# EAGLE design M105B (EAGLE 6.6.0)
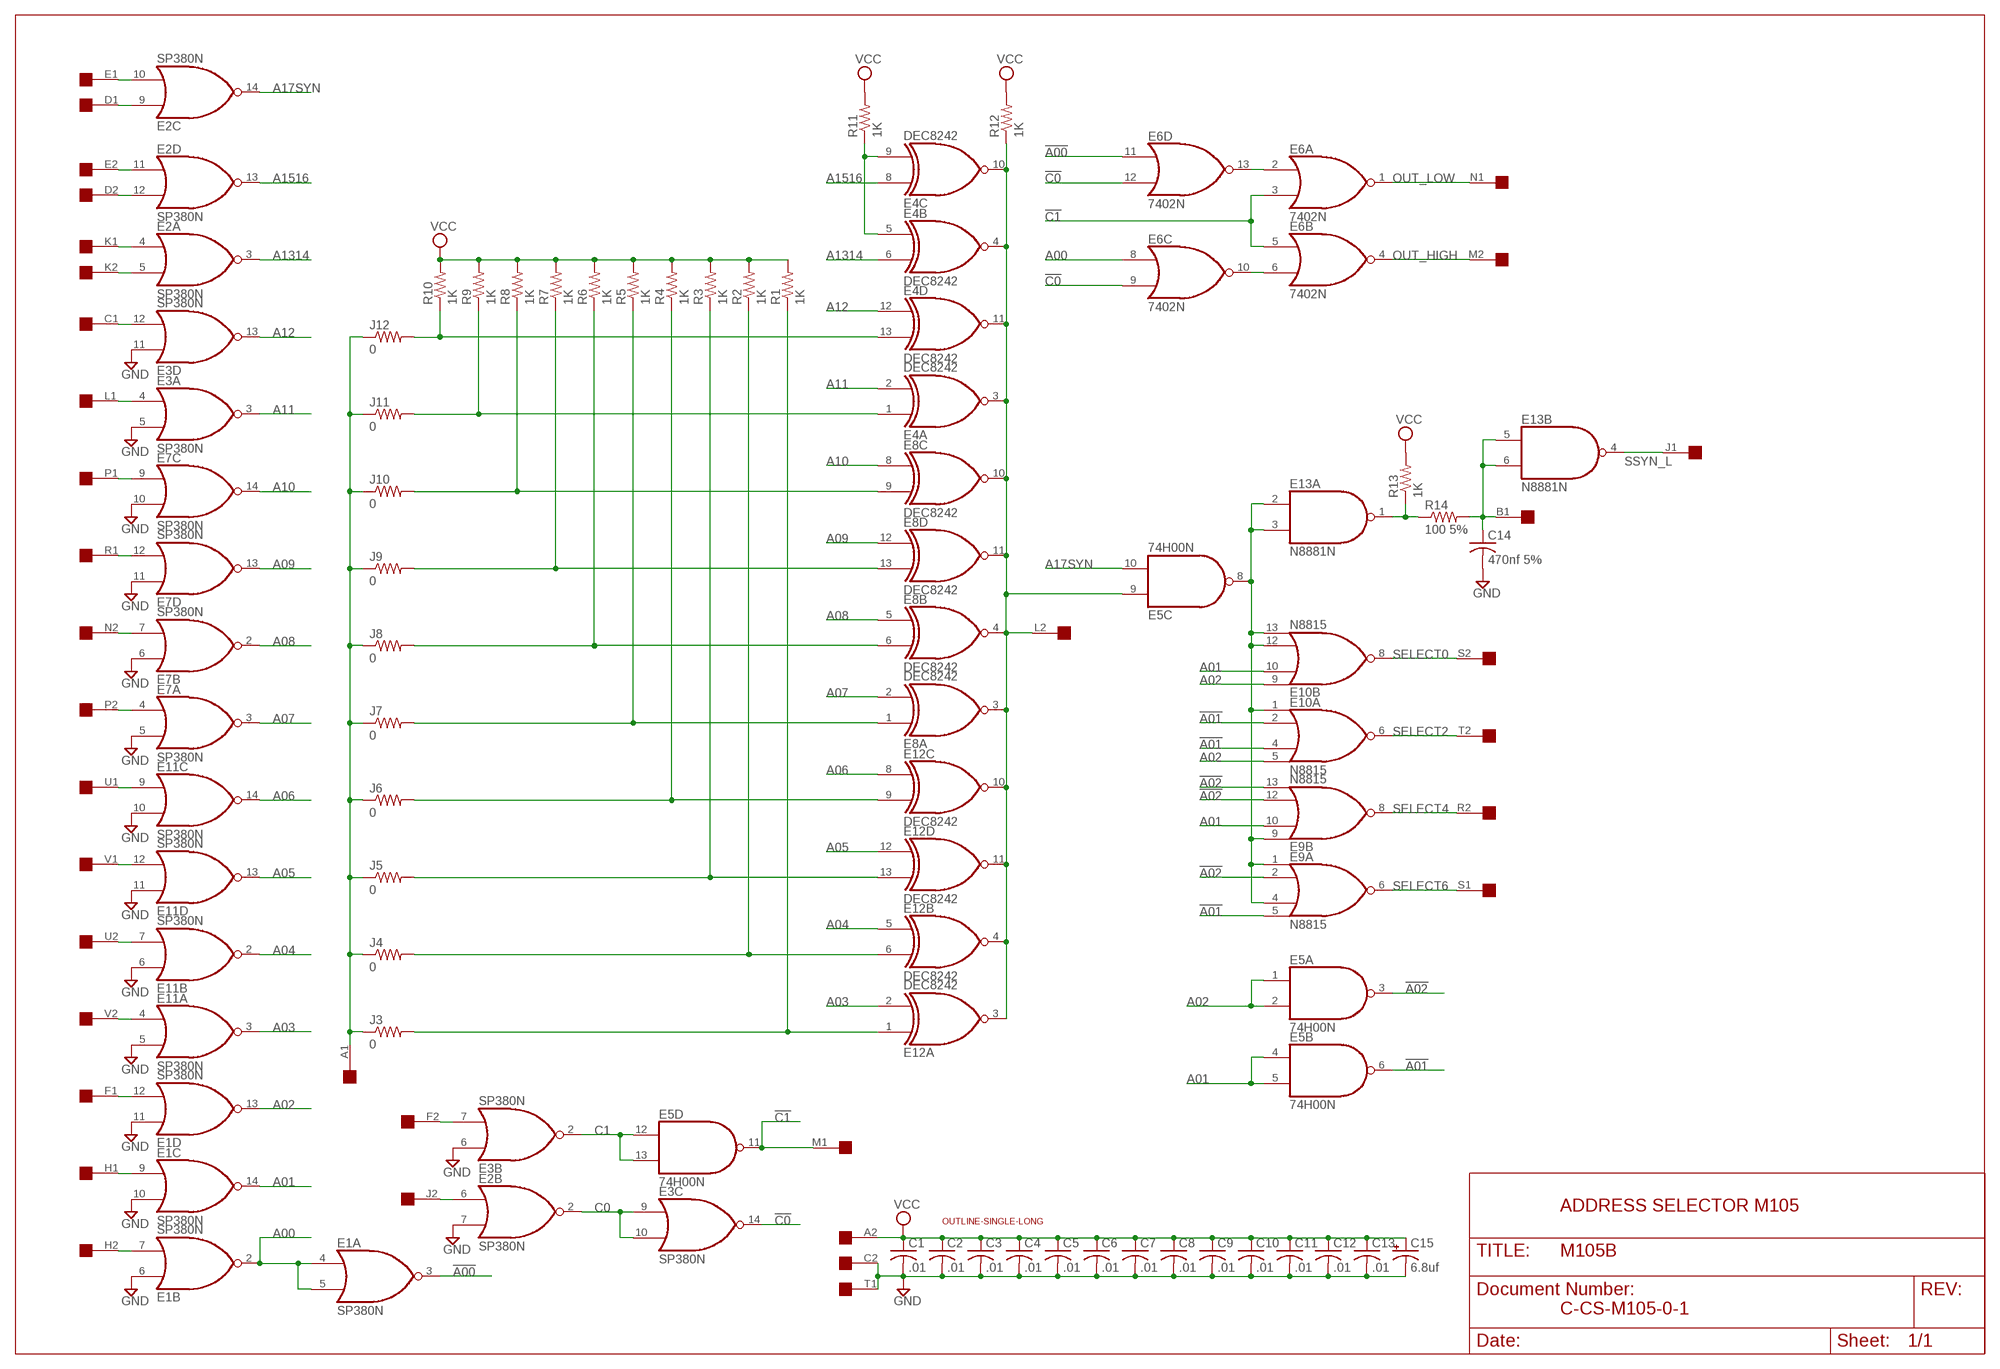
[diagram p0: schematic, sheet 1]

## Parts
C1  .01  C-US050-025X075  [C050-025X075]
C2  .01  C-US050-025X075  [C050-025X075]
C3  .01  C-US050-025X075  [C050-025X075]
C4  .01  C-US050-025X075  [C050-025X075]
C5  .01  C-US050-025X075  [C050-025X075]
C6  .01  C-US050-025X075  [C050-025X075]
C7  .01  C-US050-025X075  [C050-025X075]
C8  .01  C-US050-025X075  [C050-025X075]
C9  .01  C-US050-025X075  [C050-025X075]
C10  .01  C-US050-025X075  [C050-025X075]
C11  .01  C-US050-025X075  [C050-025X075]
C12  .01  C-US050-025X075  [C050-025X075]
C13  .01  C-US050-025X075  [C050-025X075]
C14  470nf 5%  C-US050-025X075  [C050-025X075]
C15  6.8uf  CPOL-USE15-5AXIAL  [E15-5]
E1  SP380N  [DIL14]
E2  SP380N  [DIL14]
E3  SP380N  [DIL14]
E4  DEC8242  74LS266N  [DIL14]
E5  74H00N  74S00N  [DIL14]
E6  7402N  [DIL14]
E7  SP380N  [DIL14]
E8  DEC8242  74LS266N  [DIL14]
E9  N8815  [DIL14]
E10  N8815  [DIL14]
E11  SP380N  [DIL14]
E12  DEC8242  74LS266N  [DIL14]
E13  N8881N  [DIL14]
J3  0  R-US_0207/10  [0207/10]
J4  0  R-US_0207/10  [0207/10]
J5  0  R-US_0207/10  [0207/10]
J6  0  R-US_0207/10  [0207/10]
J7  0  R-US_0207/10  [0207/10]
J8  0  R-US_0207/10  [0207/10]
J9  0  R-US_0207/10  [0207/10]
J10  0  R-US_0207/10  [0207/10]
J11  0  R-US_0207/10  [0207/10]
J12  0  R-US_0207/10  [0207/10]
R1  1K  R-US_0207/10  [0207/10]
R2  1K  R-US_0207/10  [0207/10]
R3  1K  R-US_0207/10  [0207/10]
R4  1K  R-US_0207/10  [0207/10]
R5  1K  R-US_0207/10  [0207/10]
R6  1K  R-US_0207/10  [0207/10]
R7  1K  R-US_0207/10  [0207/10]
R8  1K  R-US_0207/10  [0207/10]
R9  1K  R-US_0207/10  [0207/10]
R10  1K  R-US_0207/10  [0207/10]
R11  1K  R-US_0207/10  [0207/10]
R12  1K  R-US_0207/10  [0207/10]
R13  1K  R-US_0207/10  [0207/10]
R14  100 5%  R-US_0207/10  [0207/10]
U$1  SINGLE  [EDGE-CON2]
U$2  OUTLINE-SINGLE-LONG  [SINGLE-LONG]

## Nets
!A00: E1.3(A:O) E6.11(D:I0)
!A01: E5.6(B:O) E9.5(A:I3) E10.2(A:I1) E10.4(A:I2)
!A02: E5.3(A:O) E9.2(A:I1) E9.12(B:I2) E9.13(B:I3)
!C0: E3.14(C:O) E6.9(C:I1) E6.12(D:I1)
!C1: E5.11(D:O) E6.3(A:I1) E6.5(B:I0) U$1.M1
A00: E1.2(B:O) E1.4(A:I0) E1.5(A:I1) E6.8(C:I0)
A01: E1.14(C:O) E5.4(B:I0) E5.5(B:I1) E9.10(B:I1) E10.10(B:I1)
A02: E1.13(D:O) E5.1(A:I0) E5.2(A:I1) E10.5(A:I3) E10.9(B:I0)
A03: E11.3(A:O) E12.2(A:I1)
A04: E11.2(B:O) E12.5(B:I0)
A05: E11.13(D:O) E12.12(D:I0)
A06: E11.14(C:O) E12.8(C:I0)
A07: E7.3(A:O) E8.2(A:I1)
A08: E7.2(B:O) E8.5(B:I0)
A09: E7.13(D:O) E8.12(D:I0)
A10: E7.14(C:O) E8.8(C:I0)
A11: E3.3(A:O) E4.2(A:I1)
A12: E3.13(D:O) E4.12(D:I0)
A17SYN: E2.14(C:O) E5.10(C:I1)
A1314: E2.3(A:O) E4.6(B:I1)
A1516: E2.13(D:O) E4.8(C:I0)
C0: E2.2(B:O) E3.9(C:I0) E3.10(C:I1)
C1: E3.2(B:O) E5.12(D:I0) E5.13(D:I1)
GND [Supply]: C1.2 C2.2 C3.2 C4.2 C5.2 C6.2 C7.2 C8.2 C9.2 C10.2 C11.2 C12.2 C13.2 C14.2 C15.- E1.6(B:I0) E1.10(C:I1) E1.11(D:I0) E2.7(B:I1) E3.5(A:I1) E3.6(B:I0) E3.11(D:I0) E7.5(A:I1) E7.6(B:I0) E7.10(C:I1) E7.11(D:I0) E11.5(A:I1) E11.6(B:I0) E11.10(C:I1) E11.11(D:I0) U$1.C2 U$1.T1
N$1: E2.10(C:I1) U$1.E1
N$2: E2.9(C:I0) U$1.D1
N$3: E2.11(D:I0) U$1.E2
N$4: E2.12(D:I1) U$1.D2
N$5: E2.4(A:I0) U$1.K1
N$6: E2.5(A:I1) U$1.K2
N$7: E3.12(D:I1) U$1.C1
N$8: E3.4(A:I0) U$1.L1
N$9: E7.9(C:I0) U$1.P1
N$10: E7.7(B:I1) U$1.N2
N$11: E7.12(D:I1) U$1.R1
N$12: E7.4(A:I0) U$1.P2
N$13: E11.9(C:I0) U$1.U1
N$14: E11.12(D:I1) U$1.V1
N$15: E11.7(B:I1) U$1.U2
N$16: E11.4(A:I0) U$1.V2
N$17: E1.12(D:I1) U$1.F1
N$18: E1.7(B:I1) U$1.H2
N$19: E1.9(C:I0) U$1.H1
N$20: J3.1 J4.1 J5.1 J6.1 J7.1 J8.1 J9.1 J10.1 J11.1 J12.1 U$1.A1
N$21: E4.13(D:I1) J12.2 R10.1
N$22: E13.1(A:O) R13.1 R14.1
N$23: E2.6(B:I0) U$1.J2
N$24: E3.7(B:I1) U$1.F2
N$25: E5.8(C:O) E9.1(A:I0) E9.4(A:I2) E9.9(B:I0) E10.1(A:I0) E10.12(B:I2) E10.13(B:I3) E13.2(A:I0) E13.3(A:I1)
N$31: E4.1(A:I0) J11.2 R9.1
N$32: E4.5(B:I0) E4.9(C:I1) R11.1
N$33: E12.1(A:I0) J3.2 R1.1
N$34: E12.6(B:I1) J4.2 R2.1
N$35: E12.13(D:I1) J5.2 R3.1
N$36: E12.9(C:I1) J6.2 R4.1
N$37: E8.6(B:I1) J8.2 R6.1
N$38: E6.2(A:I0) E6.13(D:O)
N$39: E8.13(D:I1) J9.2 R7.1
N$40: E8.9(C:I1) J10.2 R8.1
N$41: E6.6(B:I1) E6.10(C:O)
N$43: E4.3(A:O) E4.4(B:O) E4.10(C:O) E4.11(D:O) E5.9(C:I0) E8.3(A:O) E8.4(B:O) E8.10(C:O) E8.11(D:O) E12.3(A:O) E12.4(B:O) E12.10(C:O) E12.11(D:O) R12.1 U$1.L2
N$44: C14.1 E13.5(B:I0) E13.6(B:I1) R14.2 U$1.B1
N$48: E8.1(A:I0) J7.2 R5.1
OUT_HIGH: E6.4(B:O) U$1.M2
OUT_LOW: E6.1(A:O) U$1.N1
SELECT0: E10.8(B:O) U$1.S2
SELECT2: E10.6(A:O) U$1.T2
SELECT4: E9.8(B:O) U$1.R2
SELECT6: E9.6(A:O) U$1.S1
SSYN_L: E13.4(B:O) U$1.J1
VCC [Supply]: C1.1 C2.1 C3.1 C4.1 C5.1 C6.1 C7.1 C8.1 C9.1 C10.1 C11.1 C12.1 C13.1 C15.+ R1.2 R2.2 R3.2 R4.2 R5.2 R6.2 R7.2 R8.2 R9.2 R10.2 R11.2 R12.2 R13.2 U$1.A2
Unconnected: E13.8(C:I0) E13.9(C:I1) E13.10(C:O) E13.11(D:I0) E13.12(D:I1) E13.13(D:O) U$1.B2

## Notes on the sheet
- ADDRESS SELECTOR M105
- C-CS-M105-0-1

## Power pins joined to a net without a drawn wire
GND: E1.1(P:GND) E2.1(P:GND) E3.1(P:GND) E4.7(P:GND) E5.7(P:GND) E6.7(P:GND) E7.1(P:GND) E8.7(P:GND) E9.7(P:GND) E10.7(P:GND) E11.1(P:GND) E12.7(P:GND) E13.7(P:GND)
VCC: E1.8(P:VCC) E2.8(P:VCC) E3.8(P:VCC) E4.14(P:VCC) E5.14(P:VCC) E6.14(P:VCC) E7.8(P:VCC) E8.14(P:VCC) E9.14(P:VCC) E10.14(P:VCC) E11.8(P:VCC) E12.14(P:VCC) E13.14(P:VCC)

## Library data of the parts
C1-C14 = rcl:C-US: CAPACITOR, American symbol
C15 = rcl:CPOL-US: POLARIZED CAPACITOR, American symbol
E1-E3 E7 E11 = dec-con:SP380: Quad NOR gate (use 8640)
E4 E8 E12 = 74xx-us:74*266: Quadruple EXCLUSIVE-NOR (XNOR), open-collector
E5 = 74xx-us:74*00: Quad 2-input NAND gate
E6 = 74xx-us:74*02: Quad 2-input NOR gate
E9 E10 = dec-con:N8815: Dual 4 Input NOR Gate
E13 = dec-con:N8881: Quad 2-input NAND gate, open collector
J3-J12 R1-R14 = rcl:R-US_: RESISTOR, American symbol
U$1 = dec-con:SINGLE: Single-Height DEC board
U$2 = dec-con:OUTLINE-*: Board outlines for DEC boards.

## Net classes
1 Supply: width 0.813 mm

## Board
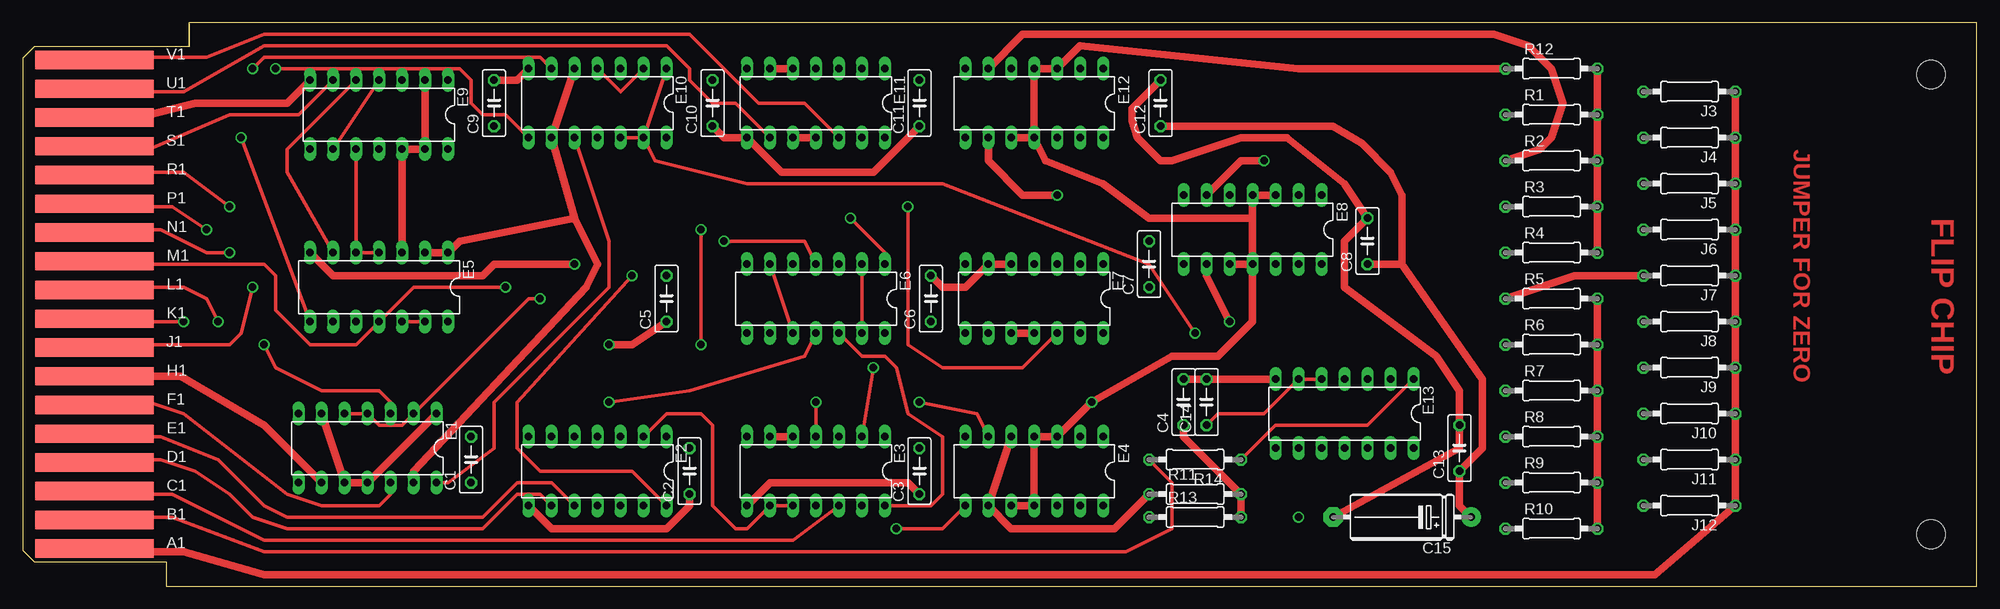
[diagram p1: board, top side]
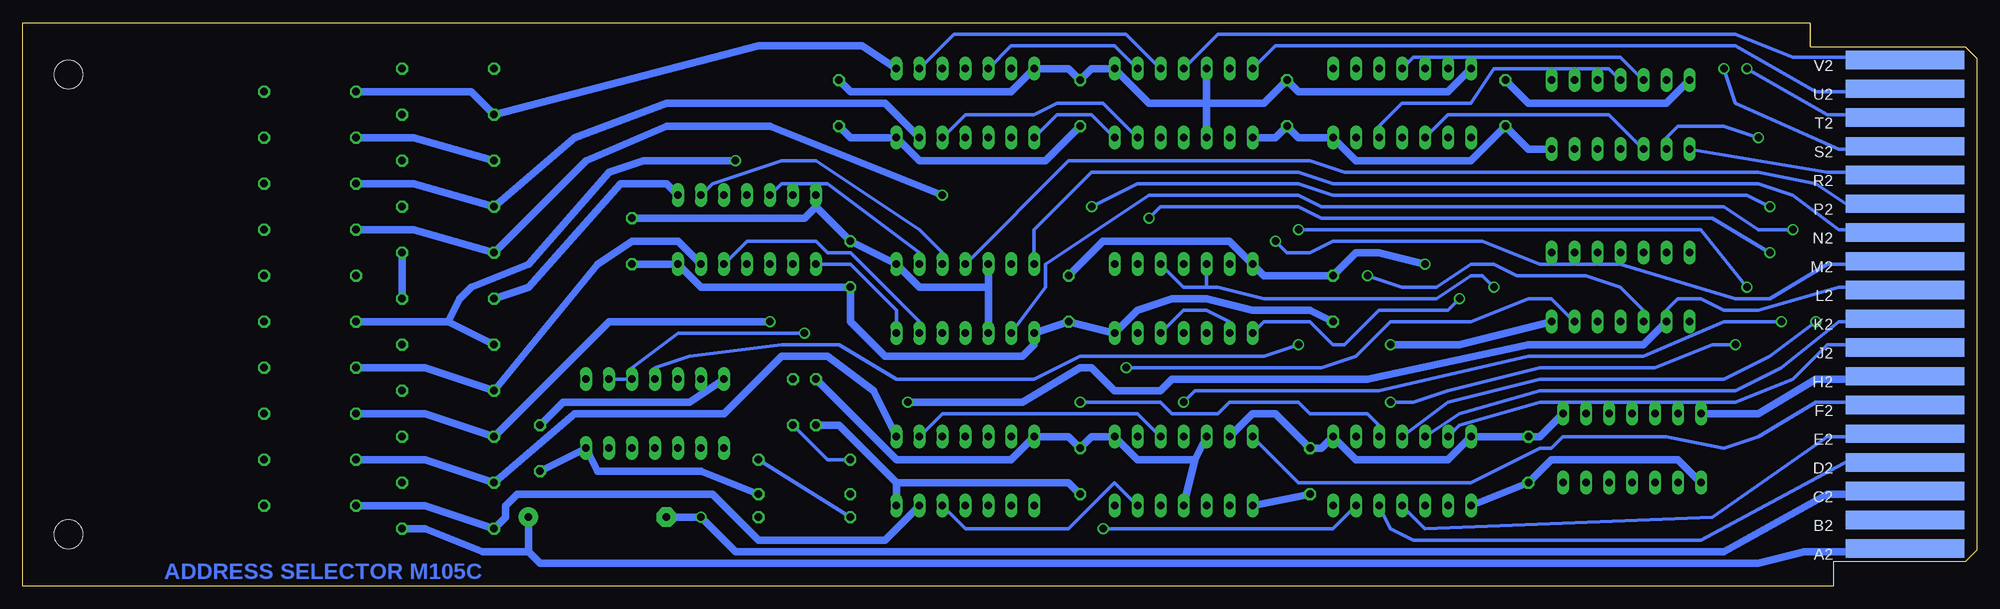
[diagram p2: board, bottom side, seen from below]

Size 215.9 x 62.23 mm. Coordinates in mm from the lower left corner, seen from the top.
Outline: 15.88,2.54 15.88,0
Copper layers (1+16): Top 0.035mm / dielectric 1.5mm / Bottom 0.035mm
Design rules "16mils": minimum track width 16mil, minimum drill 32mil, track to track 15mil, track to pad 10mil, pad to pad 10mil, via to via 10mil, smd to smd 10mil, copper to edge 13mil, drill to drill 10mil, minimum pad ring 10mil, minimum via ring 8mil, stop-mask expansion 0mil, vias tented up to drill 0mil, thermal gap 10mil

### Footprints (pad centres in the part's own frame; a part is rotated, then mirrored left to right if it is on the bottom)
C050-025X075 = drill 0.813 octagon: 1 -2.54,0; 2 2.54,0
E15-5 = drill 0.813 pad 2.159: + -7.62,0 | drill 0.813 pad 2.159 octagon: - 7.62,0
DIL14 = drill 0.813 long: 1 -7.62,-3.81; 2 -5.08,-3.81; 3 -2.54,-3.81; 4 0,-3.81; 5 2.54,-3.81; 6 5.08,-3.81; 7 7.62,-3.81; 8 7.62,3.81; 9 5.08,3.81; 10 2.54,3.81; 11 0,3.81; 12 -2.54,3.81; 13 -5.08,3.81; 14 -7.62,3.81
0207/10 = drill 0.813 octagon: 1 -5.08,0; 2 5.08,0
EDGE-CON2 = smd 13.106 x 2.032: A1 7.938,4.128; B1 7.938,7.303; C1 7.938,10.477; D1 7.938,13.652; E1 7.938,16.828; F1 7.938,20.003; H1 7.938,23.177; J1 7.938,26.352; K1 7.938,29.527; L1 7.938,32.703; M1 7.938,35.877; N1 7.938,39.053; P1 7.938,42.227; R1 7.938,45.403; S1 7.938,48.578; T1 7.938,51.752; U1 7.938,54.928; V1 7.938,58.102 | smd 13.106 x 2.032 bottom: A2 7.938,4.128; B2 7.938,7.303; C2 7.938,10.477; D2 7.938,13.652; E2 7.938,16.828; F2 7.938,20.003; H2 7.938,23.177; J2 7.938,26.352; K2 7.938,29.527; L2 7.938,32.703; M2 7.938,35.877; N2 7.938,39.053; P2 7.938,42.227; R2 7.938,45.403; S2 7.938,48.578; T2 7.938,51.752; U2 7.938,54.928; V2 7.938,58.102
SINGLE-LONG = hole 3.175: 210.82,56.515; 210.82,5.715

### Placement (x,y rotation side)
C1  49.53,13.97 90 top
C2  73.66,12.7 90 top
C3  99.06,12.7 90 top
C4  128.27,20.32 90 top
C5  71.12,31.75 90 top
C6  100.33,31.75 90 top
C7  124.46,35.56 90 top
C8  148.59,38.1 90 top
C9  52.07,53.34 90 top
C10  76.2,53.34 90 top
C11  99.06,53.34 90 top
C12  125.73,53.34 90 top
C13  158.75,15.24 90 top
C14  130.81,20.32 90 top
C15  152.4,7.62 180 top
E1  38.1,15.24 180 top
E2  63.5,12.7 180 top
E3  87.63,12.7 180 top
E4  111.76,12.7 180 top
E5  39.37,33.02 180 top
E6  87.63,31.75 180 top
E7  111.76,31.75 180 top
E8  135.89,39.37 180 top
E9  39.37,52.07 180 top
E10  63.5,53.34 180 top
E11  87.63,53.34 180 top
E12  111.76,53.34 180 top
E13  146.05,19.05 180 top
J3  184.15,54.61 180 top
J4  184.15,49.53 180 top
J5  184.15,44.45 180 top
J6  184.15,39.37 180 top
J7  184.15,34.29 180 top
J8  184.15,29.21 180 top
J9  184.15,24.13 180 top
J10  184.15,19.05 180 top
J11  184.15,13.97 180 top
J12  184.15,8.89 180 top
R1  168.91,52.07 0 top
R2  168.91,46.99 0 top
R3  168.91,41.91 0 top
R4  168.91,36.83 0 top
R5  168.91,31.75 0 top
R6  168.91,26.67 0 top
R7  168.91,21.59 0 top
R8  168.91,16.51 0 top
R9  168.91,11.43 0 top
R10  168.91,6.35 0 top
R11  129.54,10.16 0 top
R12  168.91,57.15 0 top
R13  129.54,7.62 0 top
R14  129.54,13.97 180 top
U$1  0,0 0 top
U$2  0,0 0 top

### Tracks (layer width: path | path; a pad name or v marks a point on that pad's centre or on a via)
!A00  (via drill 0.81)
  Top 0.406: E6.11 86.36,25.4 73.66,21.59 v64.77,20.32 | E1.3 40.64,20.32 39.37,21.59 33.02,21.59 27.94,24.13 v26.67,26.67
  Bottom 0.406: v64.77,20.32 62.23,20.32 58.42,21.59 48.26,24.13 35.56,24.13 29.21,26.67 v26.67,26.67
!A01
  Top 0.406: E5.6 29.21,45.72 29.21,48.26 E9.5 | E10.2 66.04,54.61 E10.4
  Bottom 0.406: E10.4 62.23,58.42 39.37,58.42 E9.5
!A02
  Top 0.813: E5.3 E9.12 E9.13 E9.2
!C0
  Top 0.406: E3.14 100.33,8.89 101.6,10.16 101.6,16.51 97.79,19.05 96.52,24.13 95.25,25.4 92.71,25.4 E6.12
  Bottom 0.406: E6.12 87.63,30.48 85.09,30.48 82.55,29.21 E6.9
!C1  (via drill 0.81)
  Top 0.406: U$1.M1 13.64,35.89 13.97,35.56 26.67,35.56 27.94,34.29 27.94,30.48 31.75,26.67 36.83,26.67 E5.11 43.18,33.02 v53.34,33.02
  Bottom 0.406: E6.3 87.63,33.02 85.09,33.02 | 85.09,33.02 E6.5 | 85.09,33.02 83.82,33.02 78.74,31.75 59.69,31.75 55.88,34.29 54.61,34.29 v53.34,33.02
A00  (via drill 0.81)
  Top 0.406: E1.5 E1.4 39.37,17.78 41.91,17.78 E1.2 55.88,31.75 v57.15,31.75
  Bottom 0.406: E6.8 78.74,29.21 73.66,29.21 71.12,26.67 69.85,26.67 66.04,30.48 58.42,30.48 v57.15,31.75
A01
  Top 0.406: E9.10 E5.5 E5.4 | E10.10 64.77,38.1 64.77,33.02 52.07,20.32 52.07,15.24 46.99,11.43 E1.14
  Bottom 0.406: E9.10 40.64,52.07 58.42,52.07 E10.10
A02
  Top 0.813: E5.2 E5.1 48.26,38.1 60.96,40.64 | 60.96,40.64 E10.9 E10.5 | E1.13 43.18,12.7 62.23,33.02 63.5,35.56 60.96,40.64
A03
  Bottom 0.406: E12.2 113.03,60.96 93.98,60.96 E11.3
A04
  Bottom 0.406: E12.5 106.68,59.69 95.25,59.69 E11.2
A05
  Bottom 0.406: E12.12 111.76,52.07 104.14,52.07 101.6,53.34 96.52,53.34 E11.13
A06
  Bottom 0.406: E12.8 101.6,52.07 97.79,52.07 E11.14
A07
  Bottom 0.406: E8.2 139.7,44.45 132.08,46.99 128.27,46.99 116.84,39.37 114.3,36.83 E7.3
A08
  Bottom 0.406: E8.5 132.08,44.45 127,44.45 116.84,36.83 E7.2
A09
  Bottom 0.406: E8.12 135.89,38.1 128.27,38.1 127,36.83 124.46,36.83 116.84,29.21 E7.13
A10
  Bottom 0.406: E8.8 124.46,35.56 119.38,30.48 E7.14
A11
  Bottom 0.406: E4.2 114.3,19.05 92.71,19.05 E3.3
A12
  Bottom 0.406: E4.12 111.76,6.35 100.33,6.35 95.25,11.43 E3.13
A17SYN  (via drill 0.81)
  Top 0.406: E2.14 67.31,12.7 57.15,12.7 54.61,15.24 54.61,20.32 v67.31,34.29
  Bottom 0.406: E5.10 36.83,30.48 39.37,33.02 43.18,34.29 50.8,34.29 53.34,35.56 55.88,35.56 59.69,33.02 63.5,33.02 v67.31,34.29
A1314  (via drill 0.81)
  Top 0.406: E4.6 105.41,19.05 v99.06,20.32
  Bottom 0.406: E2.3 66.04,17.78 67.31,19.05 73.66,19.05 74.93,20.32 82.55,20.32 83.82,19.05 88.9,19.05 90.17,20.32 v99.06,20.32
A1516  (via drill 0.81)
  Top 0.406: E4.8 101.6,6.35 v96.52,6.35
  Bottom 0.406: v96.52,6.35 71.12,6.35 E2.13
C0
  Top 0.406: E3.10 E3.9 80.01,6.35 78.74,6.35 76.2,8.89 76.2,17.78 74.93,19.05 71.12,19.05 E2.2
C1  (via drill 0.81)
  Top 0.406: E5.13 E5.12 | v93.98,24.13 E3.2
  Bottom 0.406: v93.98,24.13 72.39,24.13 68.58,25.4 64.77,29.21 55.88,29.21 49.53,31.75 46.99,31.75 E5.13
GND  (via drill 0.81)
  Top 0.813: C12.2 122.56,52.7 122.56,51.44 123.19,49.53 125.73,46.99 127,46.99 134.62,49.53 139.7,49.53 146.05,44.45 C8.2 146.05,38.1 146.05,33.02 156.21,25.4 158.75,21.59 C13.2 158.75,15.24 C15.- | C9.2 54.61,55.88 E10.7 | E11.5 E11.6 | E11.10 E11.11 | E7.10 E7.11 | E7.5 E7.6 104.14,33.02 101.6,33.02 C6.2 | E3.5 E3.6 | U$1.T1 13.64,51.74 13.97,52.07 19.05,53.34 29.21,53.34 E9.7 | C4.2 C14.2 E13.7 | E1.1 E1.11 E1.10 E1.6 | E5.7 34.29,34.29 50.8,34.29 52.07,35.56 v60.96,35.56
  Bottom 0.813: C9.2 49.53,53.34 34.29,53.34 E9.7 | C12.2 124.46,54.61 106.68,54.61 E12.7 100.33,57.15 C11.2 97.79,57.15 E11.1 91.44,53.34 85.09,53.34 | 85.09,53.34 E11.5 | 85.09,53.34 E11.10 | 85.09,53.34 78.74,53.34 C10.2 74.93,54.61 58.42,54.61 E10.7 | 109.22,33.02 E7.5 | 109.22,33.02 E7.10 | 86.36,13.97 E3.5 | 86.36,13.97 E3.11 | 128.27,41.91 129.54,40.64 C8.2 | 128.27,41.91 E8.7 | 128.27,41.91 C7.2 E7.1 116.84,33.02 109.22,33.02 | U$1.C2 8.89,10.16 16.51,10.16 27.94,3.81 137.16,3.81 v140.97,7.62 C15.- | E13.7 142.24,20.32 156.21,20.32 C13.2 | C4.2 119.38,13.97 106.68,13.97 E4.7 100.33,16.51 C3.2 97.79,16.51 E3.1 92.71,13.97 86.36,13.97 | C6.2 96.52,38.1 82.55,38.1 E6.7 78.74,34.29 C5.2 68.58,36.83 66.04,36.83 v60.96,35.56 | E3.6 80.01,19.05 77.47,19.05 C2.2 72.39,15.24 E2.1 68.58,13.97 58.42,13.97 E2.7 C1.2 48.26,16.51 E1.1
N$1
  Top 0.406: U$1.E1 13.64,16.84 13.97,16.51 15.24,16.51 21.59,13.97 26.67,8.89 29.21,7.62 50.8,7.62 54.61,11.43 58.42,11.43 E2.10
N$2
  Top 0.406: U$1.D1 13.01,13.66 13.97,13.97 15.24,13.97 19.05,12.7 22.86,10.16 25.4,7.62 29.21,6.35 50.8,6.35 54.61,10.16 57.15,10.16 E2.9
N$3
  Bottom 0.406: U$1.E2 9.83,16.84 10.16,16.51 16.51,16.51 29.21,7.62 60.96,6.35 E2.11
N$4
  Bottom 0.406: E2.12 64.77,6.35 62.23,5.08 30.48,5.08 13.97,13.97 8.89,13.97 8.59,13.66 U$1.D2
N$5  (via drill 0.81)
  Top 0.406: U$1.K1 13.67,29.52 13.97,29.21 v17.78,29.21
  Bottom 0.406: v17.78,29.21 22.86,25.4 27.94,22.86 48.26,22.86 58.42,20.32 E2.4
N$6
  Bottom 0.406: E2.5 57.15,19.05 48.26,21.59 26.67,21.59 21.59,24.13 15.24,29.21 8.89,29.21 8.59,29.52 U$1.K2
N$7
  Top 0.406: U$1.C1 13.64,10.49 13.97,10.16 16.51,10.16 26.67,5.08 85.09,5.08 E3.12
N$8  (via drill 0.81)
  Top 0.406: U$1.L1 13.64,32.69 13.97,33.02 17.78,33.02 20.32,31.75 v21.59,29.21 | v87.63,20.32 E3.4
  Bottom 0.406: v87.63,20.32 86.36,21.59 69.85,21.59 66.04,21.59 49.53,25.4 36.83,25.4 27.94,29.21 v21.59,29.21
N$9  (via drill 0.81)
  Top 0.406: U$1.P1 13.64,42.24 13.97,41.91 16.51,41.91 v20.32,39.37
  Bottom 0.406: v20.32,39.37 24.13,39.37 27.94,41.91 72.39,41.91 74.93,43.18 91.44,43.18 102.87,35.56 102.87,33.02 E7.9
N$10
  Bottom 0.406: U$1.N2 10.16,39.37 15.24,39.37 20.32,43.18 24.13,44.45 71.12,44.45 74.93,45.72 97.79,45.72 104.14,39.37 E7.7
N$11  (via drill 0.81)
  Top 0.406: U$1.R1 13.64,45.39 13.97,45.72 17.78,45.72 v22.86,41.91 | E7.12 110.49,24.13 101.6,24.13 97.79,26.67 v97.79,41.91
  Bottom 0.406: v22.86,41.91 25.4,43.18 71.12,43.18 74.93,44.45 92.71,44.45 v97.79,41.91
N$12
  Bottom 0.406: U$1.P2 8.56,42.24 8.89,41.91 13.97,41.91 17.78,44.45 24.13,45.72 69.85,45.72 73.66,46.99 100.33,46.99 E7.4
N$13
  Top 0.406: U$1.U1 13.61,54.97 13.97,54.61 17.78,54.61 26.67,59.69 71.12,59.69 73.66,57.15 73.66,55.88 76.2,53.34 78.74,53.34 E11.9
N$14
  Top 0.406: U$1.V1 13.58,58.03 13.97,58.42 20.32,58.42 26.67,60.96 73.66,60.96 81.28,53.34 86.36,53.34 E11.12
N$15
  Bottom 0.406: U$1.U2 8.53,54.97 8.89,54.61 17.78,54.61 26.67,59.69 77.47,59.69 E11.7
N$16
  Bottom 0.406: U$1.V2 8.5,58.03 8.89,58.42 20.32,58.42 26.67,60.96 83.82,60.96 E11.4
N$17
  Top 0.406: U$1.F1 13.69,20.04 13.97,20.32 17.78,19.05 29.21,10.16 33.02,8.89 39.37,8.89 40.64,10.16 E1.12
N$18
  Bottom 0.813: U$1.H2 8.56,23.19 8.89,22.86 17.78,22.86 24.13,19.05 E1.7
N$19
  Top 0.813: U$1.H1 17.45,23.19 26.67,17.78 E1.9
N$20
  Top 0.813: J3.1 J4.1 J5.1 J6.1 J7.1 J8.1 J9.1 J10.1 J11.1 J12.1 180.34,1.27 26.67,1.27 17.78,3.81 13.97,3.81 13.57,4.21 U$1.A1
N$21
  Bottom 0.813: J12.2 171.45,8.89 R10.1 162.56,7.62 162.56,8.89 161.29,10.16 139.7,10.16 134.62,5.08 120.65,5.08 E4.13
N$22
  Top 0.406: E13.1 148.59,17.78 138.43,17.78 R14.1
  Bottom 0.406: R14.1 R13.1
N$23
  Bottom 0.406: E2.6 57.15,17.78 48.26,20.32 26.67,20.32 20.32,22.86 16.51,26.67 8.89,26.67 8.56,26.34 U$1.J2
N$24
  Bottom 0.406: E3.7 74.93,11.43 55.88,11.43 48.26,15.24 46.99,15.24 45.72,16.51 34.29,16.51 27.94,15.24 24.13,16.51 17.78,20.32 8.89,20.32 8.61,20.04 U$1.F2
N$25  (via drill 0.81)
  Top 0.406: E5.8 v24.13,49.53 | E9.4 E9.9 | v129.54,27.94 124.46,35.56 101.6,44.45 80.01,44.45 69.85,46.99 E10.13 | E10.1 E10.13 | E10.12 E10.13
  Bottom 0.406: E13.2 E13.3 148.59,24.13 143.51,27.94 v129.54,27.94 | E9.9 34.29,49.53 33.02,50.8 27.94,50.8 v24.13,49.53 | E9.4 40.64,57.15 46.99,57.15 | E10.12 66.04,50.8 63.5,53.34 55.88,53.34 53.34,57.15 46.99,57.15 | E9.1 46.99,57.15
N$31
  Bottom 0.813: J11.2 171.45,13.97 R9.1 154.94,19.05 138.43,19.05 132.08,25.4 127,25.4 121.92,21.59 E4.1
N$32
  Top 0.813: R11.1 120.65,6.35 109.22,6.35 E4.9 E4.5
N$33
  Bottom 0.813: J3.2 166.37,54.61 R1.1 134.62,59.69 123.19,59.69 E12.1
N$34
  Top 0.813: R2.1 167.64,48.26 168.91,49.53 170.18,53.34 168.91,57.15 166.37,59.69 162.56,60.96 110.49,60.96 E12.6
  Bottom 0.813: J4.2 172.72,49.53 R2.1
N$35
  Bottom 0.813: J5.2 172.72,44.45 R3.1 154.94,49.53 144.78,53.34 120.65,53.34 E12.13
N$36  (via drill 0.81)
  Top 0.813: v114.3,43.18 110.49,43.18 106.68,46.99 E12.9
  Bottom 0.813: J6.2 172.72,39.37 R4.1 153.67,46.99 144.78,50.8 133.35,50.8 v114.3,43.18
N$37  (via drill 0.81)
  Top 0.813: v137.16,46.99 134.62,46.99 E8.6
  Bottom 0.813: J8.2 168.91,29.21 | 168.91,29.21 R6.1 | 168.91,29.21 167.64,31.75 166.37,33.02 160.02,35.56 151.13,45.72 147.32,46.99 v137.16,46.99
N$38
  Top 0.406: E6.2 E6.13
N$39
  Bottom 0.813: J9.2 171.45,24.13 R7.1 152.4,35.56 148.59,38.1 143.51,38.1 E8.13
N$40  (via drill 0.81)
  Top 0.813: v133.35,29.21 130.81,34.29 E8.9
  Bottom 0.813: J10.2 171.45,19.05 R8.1 151.13,29.21 v133.35,29.21
N$41
  Top 0.406: E6.6 E6.10
N$43  (via drill 0.81)
  Top 0.813: R12.1 140.97,57.15 116.84,59.69 E12.3 E12.4 E12.11 | E12.11 E12.10 | E8.3 E8.4 135.89,40.64 | E4.10 E4.11 E4.4 E4.3 v118.11,20.32 127,25.4 132.08,25.4 135.89,29.21 E8.11 | E8.11 E8.10 | 135.89,40.64 E8.11 | E12.11 113.03,46.99 119.38,44.45 124.46,40.64 135.89,40.64
  Bottom 0.406: U$1.L2 8.89,33.02 15.24,33.02 24.13,30.48 27.94,30.48 30.48,31.75 33.02,31.75 34.29,30.48 E5.9
  Bottom 0.813: v118.11,20.32 105.41,20.32 99.06,24.13 97.79,24.13 95.25,21.59 90.17,21.59 88.9,22.86 67.31,22.86 49.53,26.67 36.83,26.67 E5.9
N$44
  Top 0.406: U$1.B1 13.68,7.33 13.97,7.62 16.51,7.62 26.67,3.81 121.92,3.81 127,6.35 127,11.43 R14.2 | E13.5 E13.6 137.16,19.05 132.08,19.05 C14.1
  Bottom 0.406: C14.1 127,13.97 R14.2
N$48
  Top 0.813: J7.2 171.45,34.29 R5.1
  Bottom 0.813: R5.1 160.02,33.02 149.86,44.45 144.78,44.45 E8.1
OUT_HIGH  (via drill 0.81)
  Top 0.406: v77.47,38.1 86.36,38.1 E6.4
  Bottom 0.406: U$1.M2 8.56,35.89 8.89,35.56 16.51,35.56 22.86,31.75 26.67,31.75 39.37,35.56 48.26,35.56 54.61,38.1 71.12,38.1 73.66,36.83 76.2,36.83 v77.47,38.1
OUT_LOW  (via drill 0.81)
  Top 0.406: U$1.N1 13.64,39.04 13.97,39.37 15.24,39.37 20.32,36.83 v22.86,36.83 | E6.1 95.25,36.83 v91.44,40.64
  Bottom 0.406: v22.86,36.83 29.21,40.64 72.39,40.64 74.93,41.91 90.17,41.91 v91.44,40.64
SELECT0  (via drill 0.81)
  Top 0.406: v27.94,57.15 48.26,57.15 49.53,55.88 49.53,53.34 50.8,52.07 53.34,52.07 E10.8
  Bottom 0.406: U$1.S2 13.67,48.56 13.97,48.26 15.24,48.26 26.67,53.34 v27.94,57.15
SELECT2  (via drill 0.81)
  Top 0.406: E10.6 57.15,58.42 26.67,58.42 v25.4,57.15
  Bottom 0.406: U$1.T2 13.64,51.74 13.97,52.07 16.51,52.07 v25.4,57.15
SELECT4
  Bottom 0.406: U$1.R2 8.56,45.39 8.89,45.72 16.51,45.72 E9.8
SELECT6
  Top 0.406: U$1.S1 13.67,48.56 13.97,48.26 22.86,52.07 30.48,52.07 E9.6
SSYN_L  (via drill 0.81)
  Top 0.406: U$1.J1 13.64,26.34 13.97,26.67 22.86,26.67 24.13,27.94 v25.4,33.02 | v74.93,26.67 v74.93,39.37
  Bottom 0.406: E13.4 146.05,24.13 142.24,25.4 132.08,26.67 125.73,26.67 119.38,22.86 104.14,22.86 99.06,25.4 78.74,25.4 v74.93,26.67 | v25.4,33.02 30.48,39.37 v74.93,39.37
VCC  (via drill 0.81)
  Top 0.813: R12.2 R1.2 R2.2 R3.2 R4.2 | R5.2 R6.2 R7.2 R8.2 R9.2 R10.2 | C12.1 144.78,50.8 147.96,48.9 151.13,45.72 152.4,43.18 152.4,35.56 | 152.4,35.56 161.29,22.86 161.29,15.24 C13.1 158.75,8.89 C15.+ | 152.4,35.56 C8.1 | C11.1 93.98,45.72 83.82,45.72 E11.8 77.47,49.53 C10.1 | R13.2 R11.2 128.27,16.51 C4.1 | E2.8 58.42,6.35 71.12,6.35 73.66,8.89 C2.1 | v64.77,26.67 67.31,26.67 C5.1 | E3.8 82.55,11.43 97.79,11.43 C3.1
  Bottom 0.813: R5.2 R4.2 | C12.1 124.46,49.53 E12.14 116.84,46.99 102.87,46.99 C11.1 | E11.8 77.47,49.53 C10.1 74.93,49.53 E10.14 68.58,46.99 55.88,46.99 C9.1 49.53,48.26 E9.14 | C8.1 E8.14 140.97,33.02 C7.1 124.46,29.21 120.65,25.4 105.41,25.4 104.14,26.67 E7.8 C6.1 E6.14 92.71,30.48 88.9,31.75 85.09,31.75 80.01,30.48 73.66,30.48 C5.1 | 160.02,3.81 C15.+ | 160.02,3.81 165.1,3.81 171.45,6.35 R10.2 | U$1.A2 10.16,3.81 19.05,3.81 24.13,2.54 158.75,2.54 160.02,3.81 | C13.1 E13.14 152.4,12.7 140.97,12.7 R11.2 | C4.1 125.73,17.78 119.38,11.43 | 119.38,11.43 E4.14 | C3.1 100.33,11.43 119.38,11.43 | E5.14 57.15,26.67 v64.77,26.67 | E3.8 C2.1 | E2.8 C1.1 46.99,13.97 33.02,13.97 E1.8

### Text on the board
Top: JUMPER FOR ZERO | FLIP CHIP
Bottom: ADDRESS SELECTOR M105C
200bmp: C:/Users/Vince/Documents/eagle/projects/DEC/Mxxx/M105/M105Bbackfb.bmp
201bmp: C:/Users/Vince/Documents/eagle/projects/DEC/Mxxx/M105/M105Bfrontb.bmp